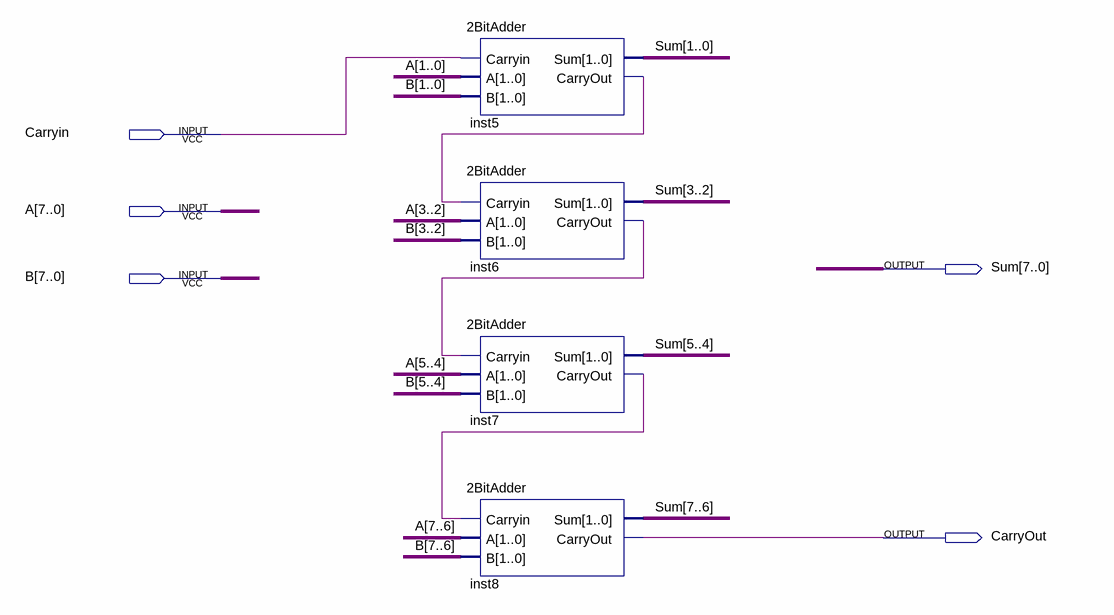
[diagram p0: schematic sheet]
// Quartus schematic 8BitAdder.bdf as structural Verilog: 4 symbols, 5 pins
module \8BitAdder  (
  input  Carryin,
  input  [7:0] A,
  input  [7:0] B,
  output [7:0] Sum,
  output CarryOut
);

  wire inst5_carryout, inst6_carryout, inst7_carryout;

  \2BitAdder  inst5 (.Carryin(Carryin), .A(A[1:0]), .B(B[1:0]), .Sum(Sum[1:0]), .CarryOut(inst5_carryout));
  \2BitAdder  inst6 (.Carryin(inst5_carryout), .A(A[3:2]), .B(B[3:2]), .Sum(Sum[3:2]), .CarryOut(inst6_carryout));
  \2BitAdder  inst7 (.Carryin(inst6_carryout), .A(A[5:4]), .B(B[5:4]), .Sum(Sum[5:4]), .CarryOut(inst7_carryout));
  \2BitAdder  inst8 (.Carryin(inst7_carryout), .A(A[7:6]), .B(B[7:6]), .Sum(Sum[7:6]), .CarryOut(CarryOut));
endmodule
